# Altium schematic sheet SR-BMS-Slave.SchDoc
size A; Designator: R
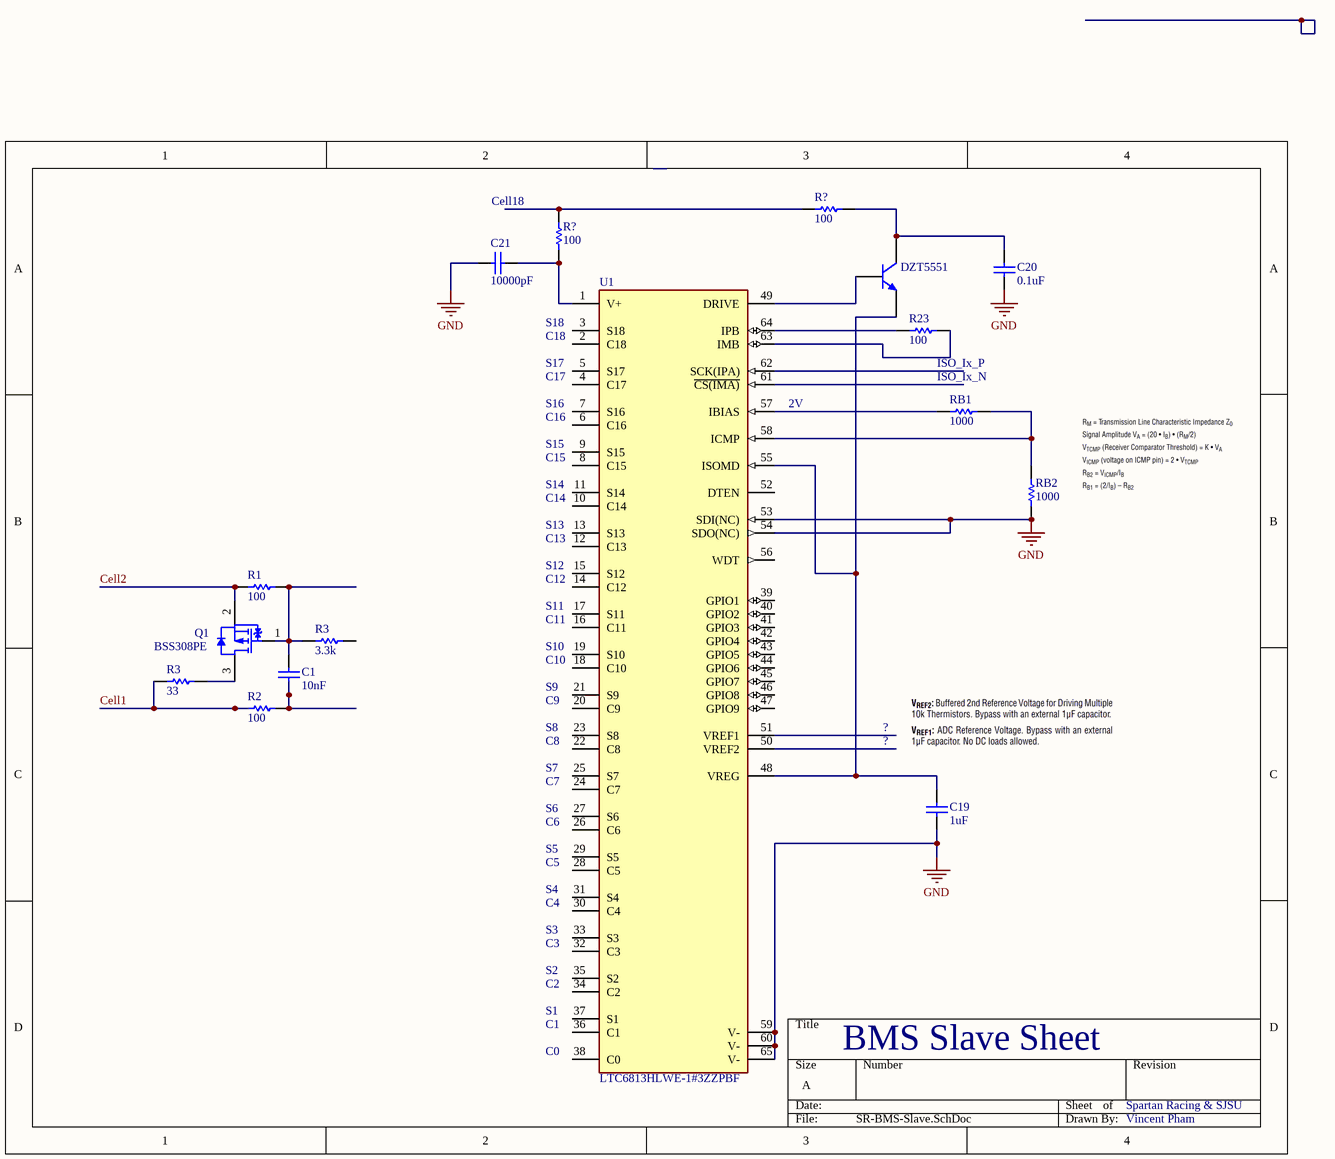
[diagram p0: SR-BMS-Slave.SchDoc]

## Parts
(Parts that share a designator on the sheet are numbered #1, #2 ... from top to bottom, then left to right.)
C1  value 10nF  (hidden comment: Capacitor)
C19  value 1uF  (hidden comment: Capacitor)
C20  value 0.1uF  (hidden comment: Capacitor)
C21  value 10000pF  (hidden comment: Capacitor)
DZT5551  Bipolar NPN 3 Pins Transistor VBIC Model  (value not drawn)
Q1  BSS308PE  [INF-PG-SOT23_L]
R1  value 100  (hidden comment: Resistor)
R2  value 100  (hidden comment: Resistor)
R3#1  value 3.3k  (hidden comment: Resistor)
R3#2  value 33  (hidden comment: Resistor)
R23  value 100  (hidden comment: Resistor)
R?#1  value 100  (hidden comment: Resistor)
R?#2  value 100  (hidden comment: Resistor)
RB1  value 1000  (hidden comment: Resistor)
RB2  value 1000  (hidden comment: Resistor)
U1  LTC6813HLWE-1#3ZZPBF  [FP-LWE-64-05-08-1982-MFG]

## Nets
GND: C19.2 C20.2 C21.1 RB2.2 U1.53(SDI(NC)) U1.54(SDO(NC)) U1.59(V-) U1.60(V-) U1.65(V-)
Cell1: R2.2 R3#2.2
Cell2: Q1.2(SOURCE) R1.2
NetC1_1: C1.1 R2.1
NetC1_2: C1.2 Q1.1(GATE) R1.1 R3#1.2
NetC19_1: C19.1 DZT5551.3(E) U1.48(VREG) U1.55(ISOMD)
NetC20_1: C20.1 DZT5551.1(C) R?#1.1
NetC21_2: C21.2 R?#2.1 U1.1(V+)
NetDZT5551_2: DZT5551.2(B) U1.49(DRIVE)
NetQ1_3: Q1.3(DRAIN) R3#2.1
NetR23_1: R23.1 U1.63(IMB)
NetR23_2: R23.2 U1.64(IPB)
NetR?#1_2: R?#1.2 R?#2.2
NetRB1_1: RB1.1 U1.57(IBIAS)
NetRB1_2: RB1.2 RB2.1 U1.58(ICMP)

Not connected (* = marked no-connect by the designer): R3#1 1; U1 2(C18) 3(S18) 4(C17) 5(S17) 6(C16) 7(S16) 8(C15) 9(S15) 10(C14) 11(S14) 12(C13) 13(S13) 14(C12) 15(S12) 16(C11) 17(S11) 18(C10) 19(S10) 20(C9) 21(S9) 22(C8) 23(S8) 24(C7) 25(S7) 26(C6) 27(S6) 28(C5) 29(S5) 30(C4) 31(S4) 32(C3) 33(S3) 34(C2) 35(S2) 36(C1) 37(S1) 38(C0) 39(GPIO1) 40(GPIO2) 41(GPIO3) 42(GPIO4) 43(GPIO5) 44(GPIO6) 45(GPIO7) 46(GPIO8) 47(GPIO9) 50(VREF2) 51(VREF1) 52(DTEN) 56(WDT) 61(~{CS(IMA)}) 62(SCK(IPA))

## Notes on the sheet
- Cell18
- (near U1) S18
- (near U1) C18
- (near U1) S17
- ISO_Ix_P
- (near U1) C17
- (near U1) S16
- (near U1) C16
- (near U1) 2V
- ISO_Ix_N
- (near U1) S15
- (near U1) C15
- (near U1) S14
- (near U1) C14
- (near U1) S13
- (near U1) C13
- (near U1) S12
- (near U1) C12
- (near U1) S11
- (near U1) C11
- (near U1) S10
- (near U1) C10
- (near U1) S9
- (near U1) C9
- (near U1) C8
- (near U1) S8
- (near U1) S7
- ?
- (near U1) C7
- (near U1) S6
- (near U1) C6
- (near U1) S5
- (near U1) C5
- (near U1) S4
- (near U1) C4
- (near U1) S3
- (near U1) C3
- (near U1) S2
- (near U1) C2
- (near U1) S1
- (near U1) C1
- (near U1) C0
- BMS Slave Sheet
- Spartan Racing & SJSU
- Vincent Pham

## Library data of the parts
C1 C19-C21 = Capacitor: SimulationGenericComponent: True
DZT5551 = BJT NPN VBIC: SimulationGenericComponent: True; AFN: 1; AJC: -0.5; ART: 0.1; AVC1: 0; EA: 1.12; FC: 0.9; IBBE: 1e-06; IBCI: 1e-16; IBEI: 1e-18; MC: 0.33; NCN: 2; NKF: 0.5; PC: 0.75; TNOM: 27; VERS: 1.2; XII: 3; AJE: -0.5; AJS: -0.5; AVC2: 0; BFN: 1; CBCO: 0; CBEO: 0; CCSO: 0; CJC: 0; CJCP: 0; CJE: 0; CJEP: 0; CTH: 0; DEAR: 0; EAIC: 1.12; EAIE: 1.12; EAIS: 1.12; EANC: 1.12; EANE: 1.12; EANS: 1.12; EAP: 1.12; EBBE: 0; GAMM: 0; HRCF: 1; IBCIP: 0; IBCN: 0; IBCNP: 0; IBEIP: 0; IBEN: 0; IBENP: 0; IKF: 0; IKP: 0; IKR: 0; IS: 1e-16; ISP: 0; ISRR: 1; ITF: 0; KFN: 0; ME: 0.33; MS: 0.33; NBBE: 1; NCI: 1; NCIP: 1; NCNP: 2; NEI: 1; NEN: 2; NF: 1; NFP: 1; NR: 1; PE: 0.75; PS: 0.75; QBM: 0; QCO: 0; QTF: 0; RBI: 0.1; RBP: 0.1; RBX: 0; RCI: 0.1; RCX: 0; RE: 0; RS: 0; RTH: 0; TAVC: 0; TD: 0; TF: 0; TNBBE: 0; TNF: 0; TR: 0; TVBBE1: 0; TVBBE2: 0; VBBE: 0; VEF: 0; VER: 0; VO: 0; VREF: 0; VRT: 0; VTF: 0; WBE: 1; WSP: 1; XIKF: 0; XIN: 3; XIS: 3; XISR: 0; XRBI: 0; XRBP: 0; XRBX: 0; XRCI: 0; XRCX: 0; XRE: 0; XRS: 0; XTF: 0; XVO: 0
Q1 = CMP-1099-00030-1: P-Channel OptiMOS P3 Small-Signal-Transistor, -30 V VDS, -2 A ID, -55 to 150 degC, PG-SOT23, Reel, Green; Manufacturer: Infineon; RDS (on) (max) (@4.5V): 130Â mOhm; Pto t (max): 0.5Â W; ID (max): -2Â A; IDpuls (max): -8Â A; VDS (max): -30Â V; VGS(th) (min): -2Â V; Green: TRUE; RDS (on) (max): 80Â mOhm; QG: -5Â nC; Rth: 250Â K/W; VGS(th) (max): -1Â V; PartNumber: BSS308PE; ComponentLink3Description: Package Specification; PackageDescription: 3-Pin Small Outline Transistor Package, 2.9 x 1.3 mm Body, 0.95 mm Pitch; Mounting Technology: Surface Mount; Packing: Reel; PackageReference: PG-SOT23; PackageVersion: Apr-08; Halogen-free: TRUE; DatasheetVersion: Rev. 2.03; ComponentLink2URL: http://www.infineon.com/dgdl/BSS308PE_Rev23_.pdf?folderId=db3a304314dca38901154a72e3951a65&fileId=db3a304330f686060131099c80400073; ComponentLink2Description: Datasheet; ComponentLink1Description: Manufacturer URL; ComponentLink1URL: http://www.infineon.com/; ComponentLink3URL: http://www.infineon.com/dgdl/SOT23-Package_Overview.pdf?folderId=db3a30431936bc4b0119532290053c66&fileId=db3a30431936bc4b0119533468123c85
R1 R2 R3#1 R3#2 R23 R?#1 R?#2 RB1 RB2 = Resistor: TC1: 0; SimulationGenericComponent: True; TC2: 0
U1 = CMP-09132-000002-1: 18 CHANNEL MULTICELL BATTERY STA; Manufacturer: Analog Devices; Number Of Outputs: 1; Min Supply Voltage: 2.7V; Max Junction Temp: +125°C; Number Of Cells: 18; Output Voltage: 5.7V; Standoff Height: 0.05mm; Nominal Supply Current: 3-6.1uA; Automotive Grade: Grade 1; Max Supply Voltage: 3.6V; Temperature: -40°C to +125°C; Temperature Range Low: -40°C; Lead Free: Yes; Device Class L1: Integrated Circuits (ICs); ComponentLink2Description: Datasheet; ComponentLink2URL: https://www.analog.com/media/en/technical-documentation/data-sheets/LTC6813-1.pdf; Height: 1.6mm; Package: LWE-64-05-08-1982; Digikey Description: 18 CHANNEL MULTICELL BATTERY STA; RoHS: TRUE; Category: IC; Octopart: https://octopart.com/ltc6813hlwe-1%233zzpbf-analog+devices-90390400; Temperature Range High: +125°C; Automotive: Yes; Manufacturer Part Number: LTC6813HLWE-1#3ZZPBF; Device Class L3: Battery Management; Device Class L2: Power Management ICs; Ipc Land Pattern Name: QFP50P1200X1200X160-64